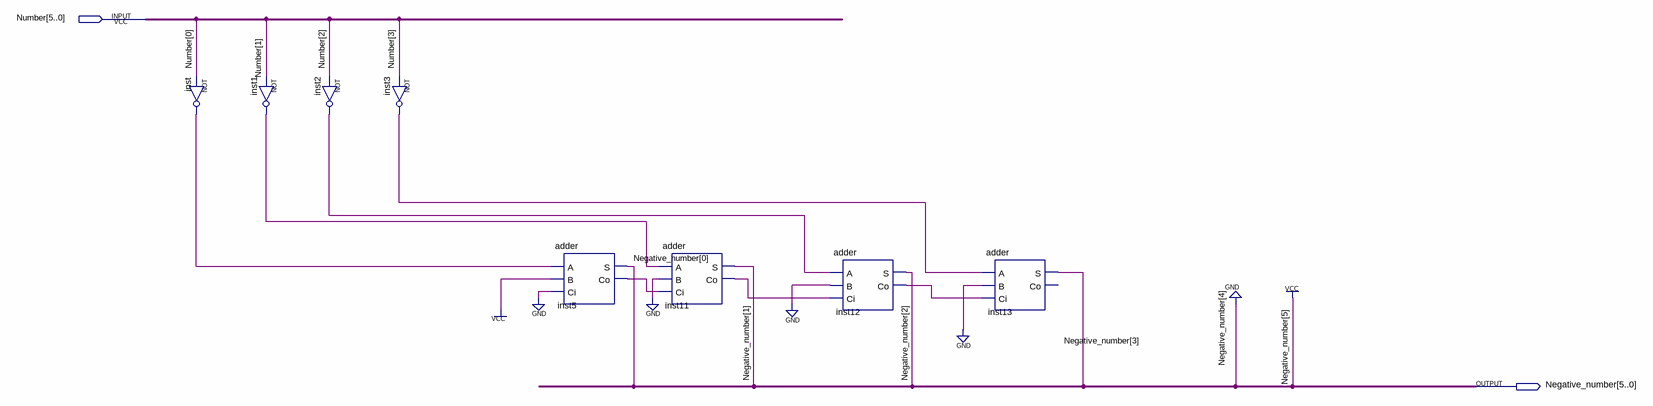
[diagram p0: schematic sheet]
// Quartus schematic C2_FINAL.bdf as structural Verilog: 8 symbols, 2 pins
module C2_FINAL (
  input  [5:0] Number,
  output [5:0] Negative_number
);

  wire inst1_out, inst2_out, inst3_out, inst5_co, inst11_co, inst12_co, inst_out;

  not inst (inst_out, Number[0]);
  not inst1 (inst1_out, Number[1]);
  not inst2 (inst2_out, Number[2]);
  not inst3 (inst3_out, Number[3]);
  adder inst5 (.A(inst_out), .B(1'b1), .Ci(1'b0), .S(Negative_number[0]), .Co(inst5_co));
  adder inst11 (.A(inst1_out), .B(1'b0), .Ci(inst5_co), .S(Negative_number[1]), .Co(inst11_co));
  adder inst12 (.A(inst2_out), .B(1'b0), .Ci(inst11_co), .S(Negative_number[2]), .Co(inst12_co));
  adder inst13 (.A(inst3_out), .B(1'b0), .Ci(inst12_co), .S(Negative_number[3]));  // open: Co

  assign Negative_number[5:4] = 2'b10;
endmodule
